# EAGLE design IPS_PilotCape (EAGLE 8.2.2)

## Sheet 1 of 2
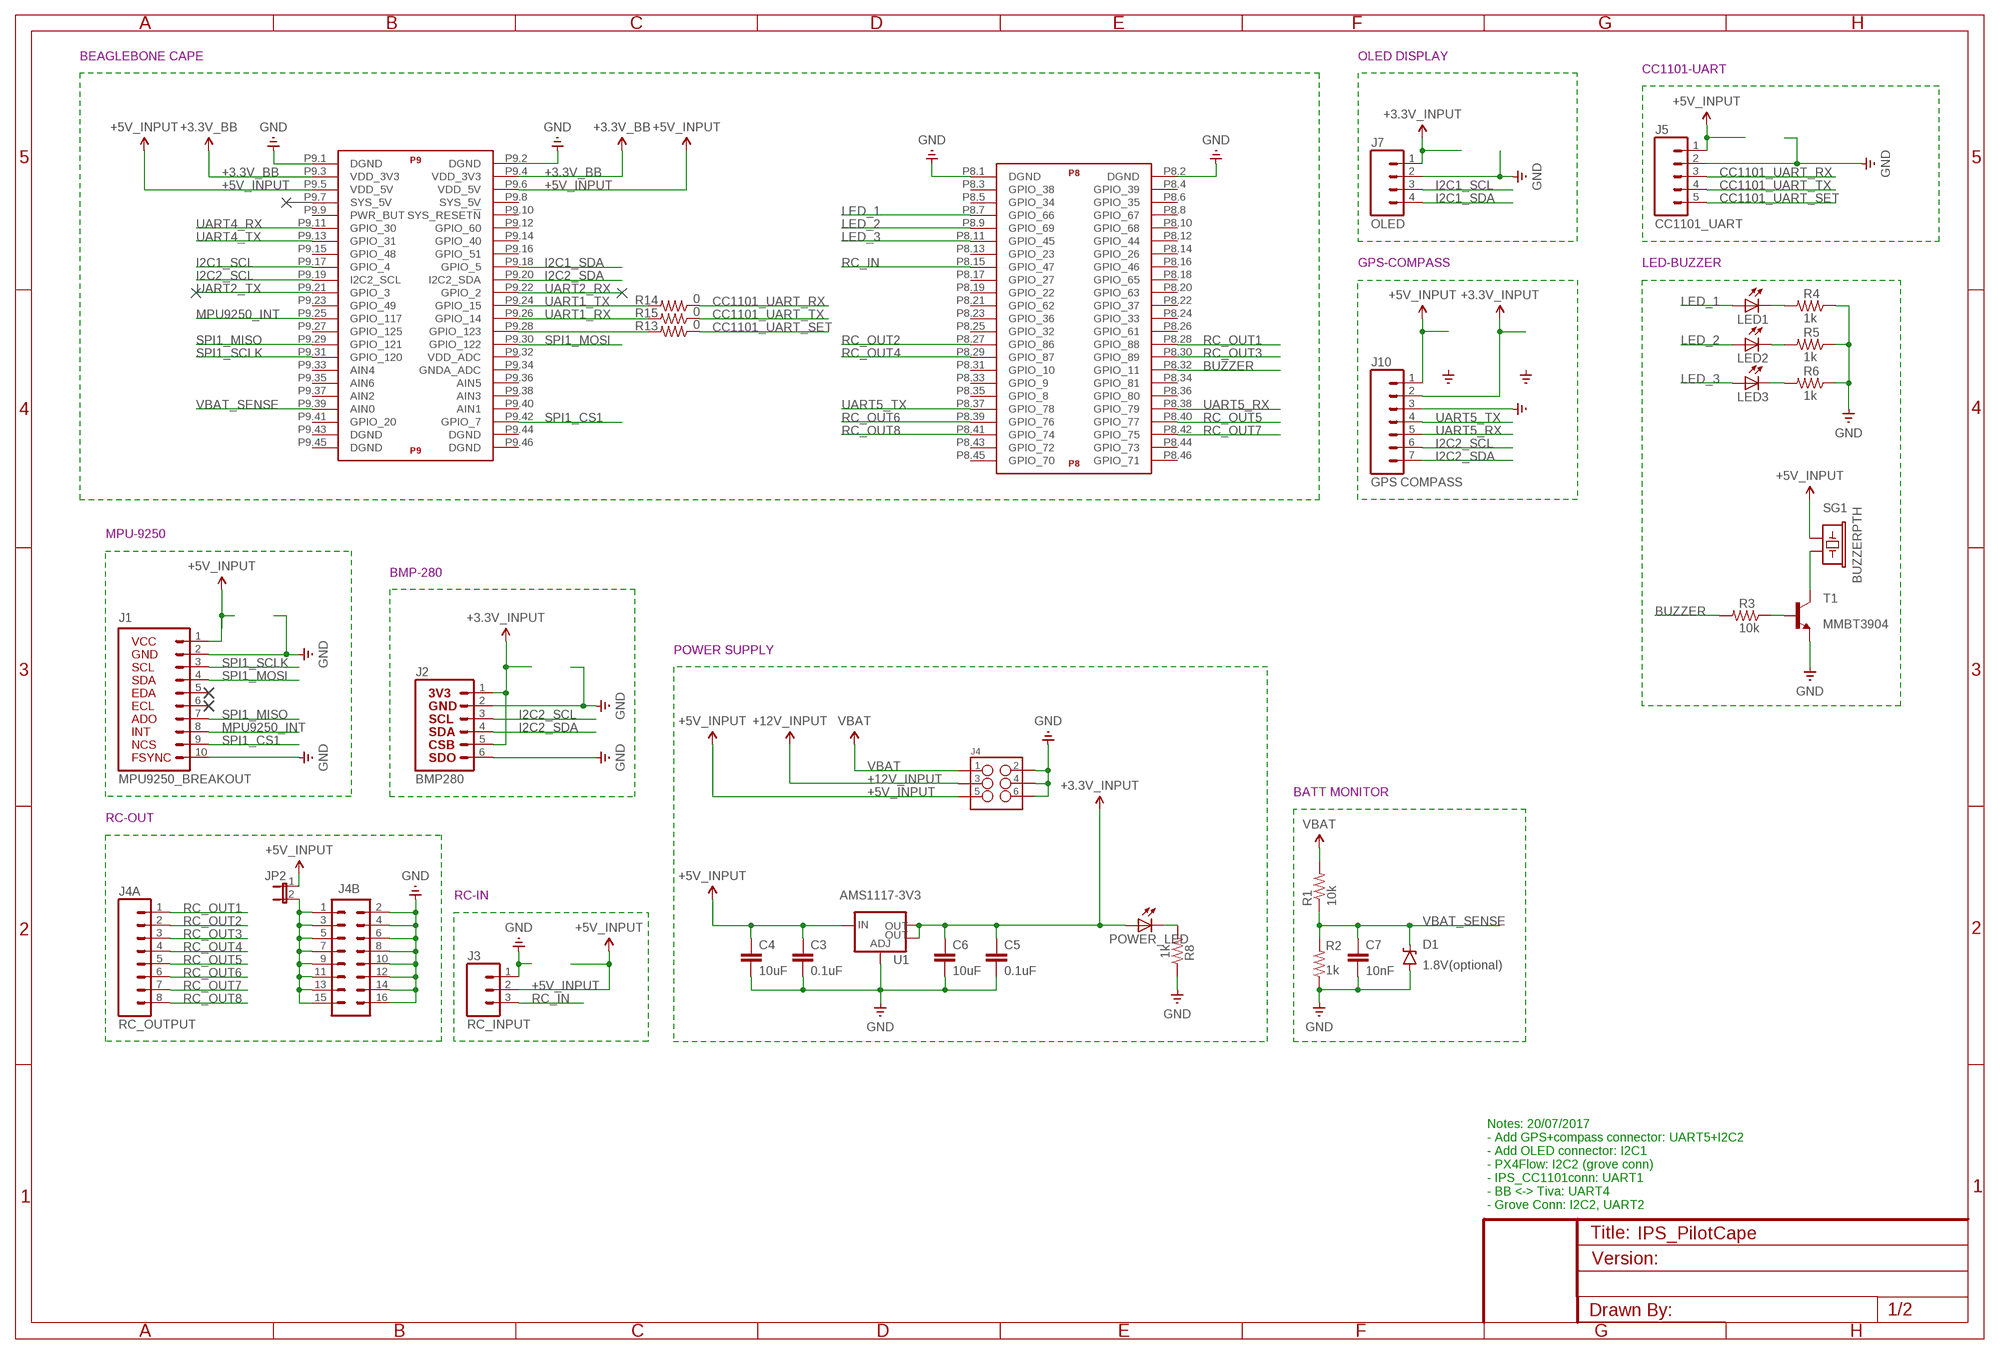
[diagram p0: schematic, sheet 1]
FRAME1 (FRAME-A3): DESIGNER: NGHIAJENIUS; VERSION: 1.0

### Parts
C3  0.1uF  CAP0603-CAP  [0603-CAP]
C4  10uF  CAP1210  [1210]
C5  0.1uF  CAP0603-CAP  [0603-CAP]
C6  10uF  CAP1210  [1210]
C7  10nF  CAP0603-CAP  [0603-CAP]
D1  1.8V(optional)  DIODE-ZENER3.3V  [SOD-323]
J1  MPU9250_BREAKOUT  [MPU9250_BREAKOUT]
J2  BMP280  [BMP280]
J3  RC_INPUT  M03PTH  [1X03]
J4  M03X2NO_SILK  [2X3-NS]
J4A  RC_OUTPUT  M08SILK_FEMALE_PTH  [1X08]
J4B  M08X2  [2X8]
J5  CC1101_UART  M05PTH  [1X05]
J7  OLED  M04PTH  [1X04]
J10  GPS COMPASS  M07  [1X07]
JP2  JUMPER-2PTH  [1X02]
LED1  LEDCHIPLED_0805  [CHIPLED_0805]
LED2  LEDCHIPLED_0805  [CHIPLED_0805]
LED3  LEDCHIPLED_0805  [CHIPLED_0805]
POWER_LED  LEDCHIPLED_0805  [CHIPLED_0805]
R1  10k  R-US_R0603  [R0603]
R2  1k  R-US_R0603  [R0603]
R3  10k  R-US_R0603  [R0603]
R4  1k  R-US_R0603  [R0603]
R5  1k  R-US_R0603  [R0603]
R6  1k  R-US_R0603  [R0603]
R8  1k  R-US_R0603  [R0603]
R13  0  R-US_R0603  [R0603]
R14  0  R-US_R0603  [R0603]
R15  0  R-US_R0603  [R0603]
SG1  BUZZERPTH  [BUZZER-12MM]
T1  MMBT3904  MMBT3904LT1-NPN-SOT23-BEC  [SOT23-BEC]
U1  AMS1117-3V3  V_REG_LM1117SOT223  [SOT223]
U$2  BEAGLE_BONE_BLACK_CAPE  [BEAGLE_BONE_BLACK_CAPE]

### Nets
+3.3V_BB: U$2.P9.3(P9:VDD_3V3) U$2.P9.4(P9:VDD_3V3)
+3.3V_INPUT: C5.1 C6.1 J2.1 J2.5 J7.1 J10.2 POWER_LED.A U1.2(OUT) U1.4(OUT) ; also sheet 2
+5V_INPUT: C3.1 C4.1 J1.1 J3.2 J4.5 J5.1 J10.1 JP2.1 SG1.+ U1.3(IN) U$2.P9.5(P9:VDD_5V) U$2.P9.6(P9:VDD_5V) ; also sheet 2
+12V_INPUT: J4.3 ; also sheet 2
BUZZER: R3.2 U$2.P8.32(P8:GPIO_11)
CC1101_UART_RX: J5.3 R14.1 ; also sheet 2
CC1101_UART_SET: J5.5 R13.1
CC1101_UART_TX: J5.4 R15.1 ; also sheet 2
GND: C3.2 C4.2 C5.2 C6.2 C7.2 D1.A J1.2 J1.10 J2.2 J2.6 J3.1 J4.2 J4.4 J4.6 J4B.2 J4B.4 J4B.6 J4B.8 J4B.10 J4B.12 J4B.14 J4B.16 J5.2 J7.2 J10.3 R2.1 R4.1 R5.1 R6.1 R8.1 T1.E U1.1(ADJ) U$2.P8.1(P8:DGND) U$2.P8.2(P8:DGND) U$2.P9.1(P9:DGND) U$2.P9.2(P9:DGND) ; also sheet 2
I2C1_SCL: J7.3 U$2.P9.17(P9:GPIO_4)
I2C1_SDA: J7.4 U$2.P9.18(P9:GPIO_5)
I2C2_SCL: J2.3 J10.6 U$2.P9.19(P9:I2C2_SCL)
I2C2_SDA: J2.4 J10.7 U$2.P9.20(P9:I2C2_SDA)
LED_1: LED1.A U$2.P8.7(P8:GPIO_66)
LED_2: LED2.A U$2.P8.9(P8:GPIO_69)
LED_3: LED3.A U$2.P8.11(P8:GPIO_45)
MPU9250_INT: J1.8 U$2.P9.25(P9:GPIO_117)
N$3: J4B.1 J4B.3 J4B.5 J4B.7 J4B.9 J4B.11 J4B.13 J4B.15 JP2.2
N$8: SG1.- T1.C
N$9: R3.1 T1.B
N$13: LED1.C R4.2
N$14: LED2.C R5.2
N$15: LED3.C R6.2
N$30: POWER_LED.C R8.2
N$34: R13.2 U$2.P9.28(P9:GPIO_123)
RC_IN: J3.3 U$2.P8.15(P8:GPIO_47)
RC_OUT1: J4A.1 U$2.P8.28(P8:GPIO_88)
RC_OUT2: J4A.2 U$2.P8.27(P8:GPIO_86)
RC_OUT3: J4A.3 U$2.P8.30(P8:GPIO_89)
RC_OUT4: J4A.4 U$2.P8.29(P8:GPIO_87)
RC_OUT5: J4A.5 U$2.P8.40(P8:GPIO_77)
RC_OUT6: J4A.6 U$2.P8.39(P8:GPIO_76)
RC_OUT7: J4A.7 U$2.P8.42(P8:GPIO_75)
RC_OUT8: J4A.8 U$2.P8.41(P8:GPIO_74)
SPI1_CS1: J1.9 U$2.P9.42(P9:GPIO_7)
SPI1_MISO: J1.7 U$2.P9.29(P9:GPIO_121)
SPI1_MOSI: J1.4 U$2.P9.30(P9:GPIO_122)
SPI1_SCLK: J1.3 U$2.P9.31(P9:GPIO_120)
UART1_RX: R15.2 U$2.P9.26(P9:GPIO_14)
UART1_TX: R14.2 U$2.P9.24(P9:GPIO_15)
UART2_RX: U$2.P9.22(P9:GPIO_2)
UART2_TX: U$2.P9.21(P9:GPIO_3)
UART4_RX: U$2.P9.11(P9:GPIO_30) ; also sheet 2
UART4_TX: U$2.P9.13(P9:GPIO_31) ; also sheet 2
UART5_RX: J10.5 U$2.P8.38(P8:GPIO_79)
UART5_TX: J10.4 U$2.P8.37(P8:GPIO_78)
VBAT: J4.1 R1.2
VBAT_SENSE: C7.1 D1.C R1.1 R2.2 U$2.P9.39(P9:AIN0)
Unconnected: J1.5 J1.6 U$2.P8.3(P8:GPIO_38) U$2.P8.4(P8:GPIO_39) U$2.P8.5(P8:GPIO_34) U$2.P8.6(P8:GPIO_35) U$2.P8.8(P8:GPIO_67) U$2.P8.10(P8:GPIO_68) U$2.P8.12(P8:GPIO_44) U$2.P8.13(P8:GPIO_23) U$2.P8.14(P8:GPIO_26) U$2.P8.16(P8:GPIO_46) U$2.P8.17(P8:GPIO_27) U$2.P8.18(P8:GPIO_65) U$2.P8.19(P8:GPIO_22) U$2.P8.20(P8:GPIO_63) U$2.P8.21(P8:GPIO_62) U$2.P8.22(P8:GPIO_37) U$2.P8.23(P8:GPIO_36) U$2.P8.24(P8:GPIO_33) U$2.P8.25(P8:GPIO_32) U$2.P8.26(P8:GPIO_61) U$2.P8.31(P8:GPIO_10) U$2.P8.33(P8:GPIO_9) U$2.P8.34(P8:GPIO_81) U$2.P8.35(P8:GPIO_8) U$2.P8.36(P8:GPIO_80) U$2.P8.43(P8:GPIO_72) U$2.P8.44(P8:GPIO_73) U$2.P8.45(P8:GPIO_70) U$2.P8.46(P8:GPIO_71) U$2.P9.7(P9:SYS_5V) U$2.P9.8(P9:SYS_5V) U$2.P9.9(P9:PWR_BUT) U$2.P9.10(P9:SYS_RESET!N) U$2.P9.12(P9:GPIO_60) U$2.P9.14(P9:GPIO_40) U$2.P9.15(P9:GPIO_48) U$2.P9.16(P9:GPIO_51) U$2.P9.23(P9:GPIO_49) U$2.P9.27(P9:GPIO_125) U$2.P9.32(P9:VDD_ADC) U$2.P9.33(P9:AIN4) U$2.P9.34(P9:GNDA_ADC) U$2.P9.35(P9:AIN6) U$2.P9.36(P9:AIN5) U$2.P9.37(P9:AIN2) U$2.P9.38(P9:AIN3) U$2.P9.40(P9:AIN1) U$2.P9.41(P9:GPIO_20) U$2.P9.43(P9:DGND) U$2.P9.44(P9:DGND) U$2.P9.45(P9:DGND) U$2.P9.46(P9:DGND)

### Notes on the sheet
- BEAGLEBONE CAPE | OLED DISPLAY
- CC1101-UART
- GPS-COMPASS | LED-BUZZER
- MPU-9250
- BMP-280
- POWER SUPPLY
- BATT MONITOR
- RC-OUT
- RC-IN
- Notes: 20/07/2017
  - Add GPS+compass connector: UART5+I2C2
  - Add OLED connector: I2C1
  - PX4Flow: I2C2 (grove conn)
  - IPS_CC1101conn: UART1
  - BB <-> Tiva: UART4
  - Grove Conn: I2C2, UART2

## Sheet 2 of 2
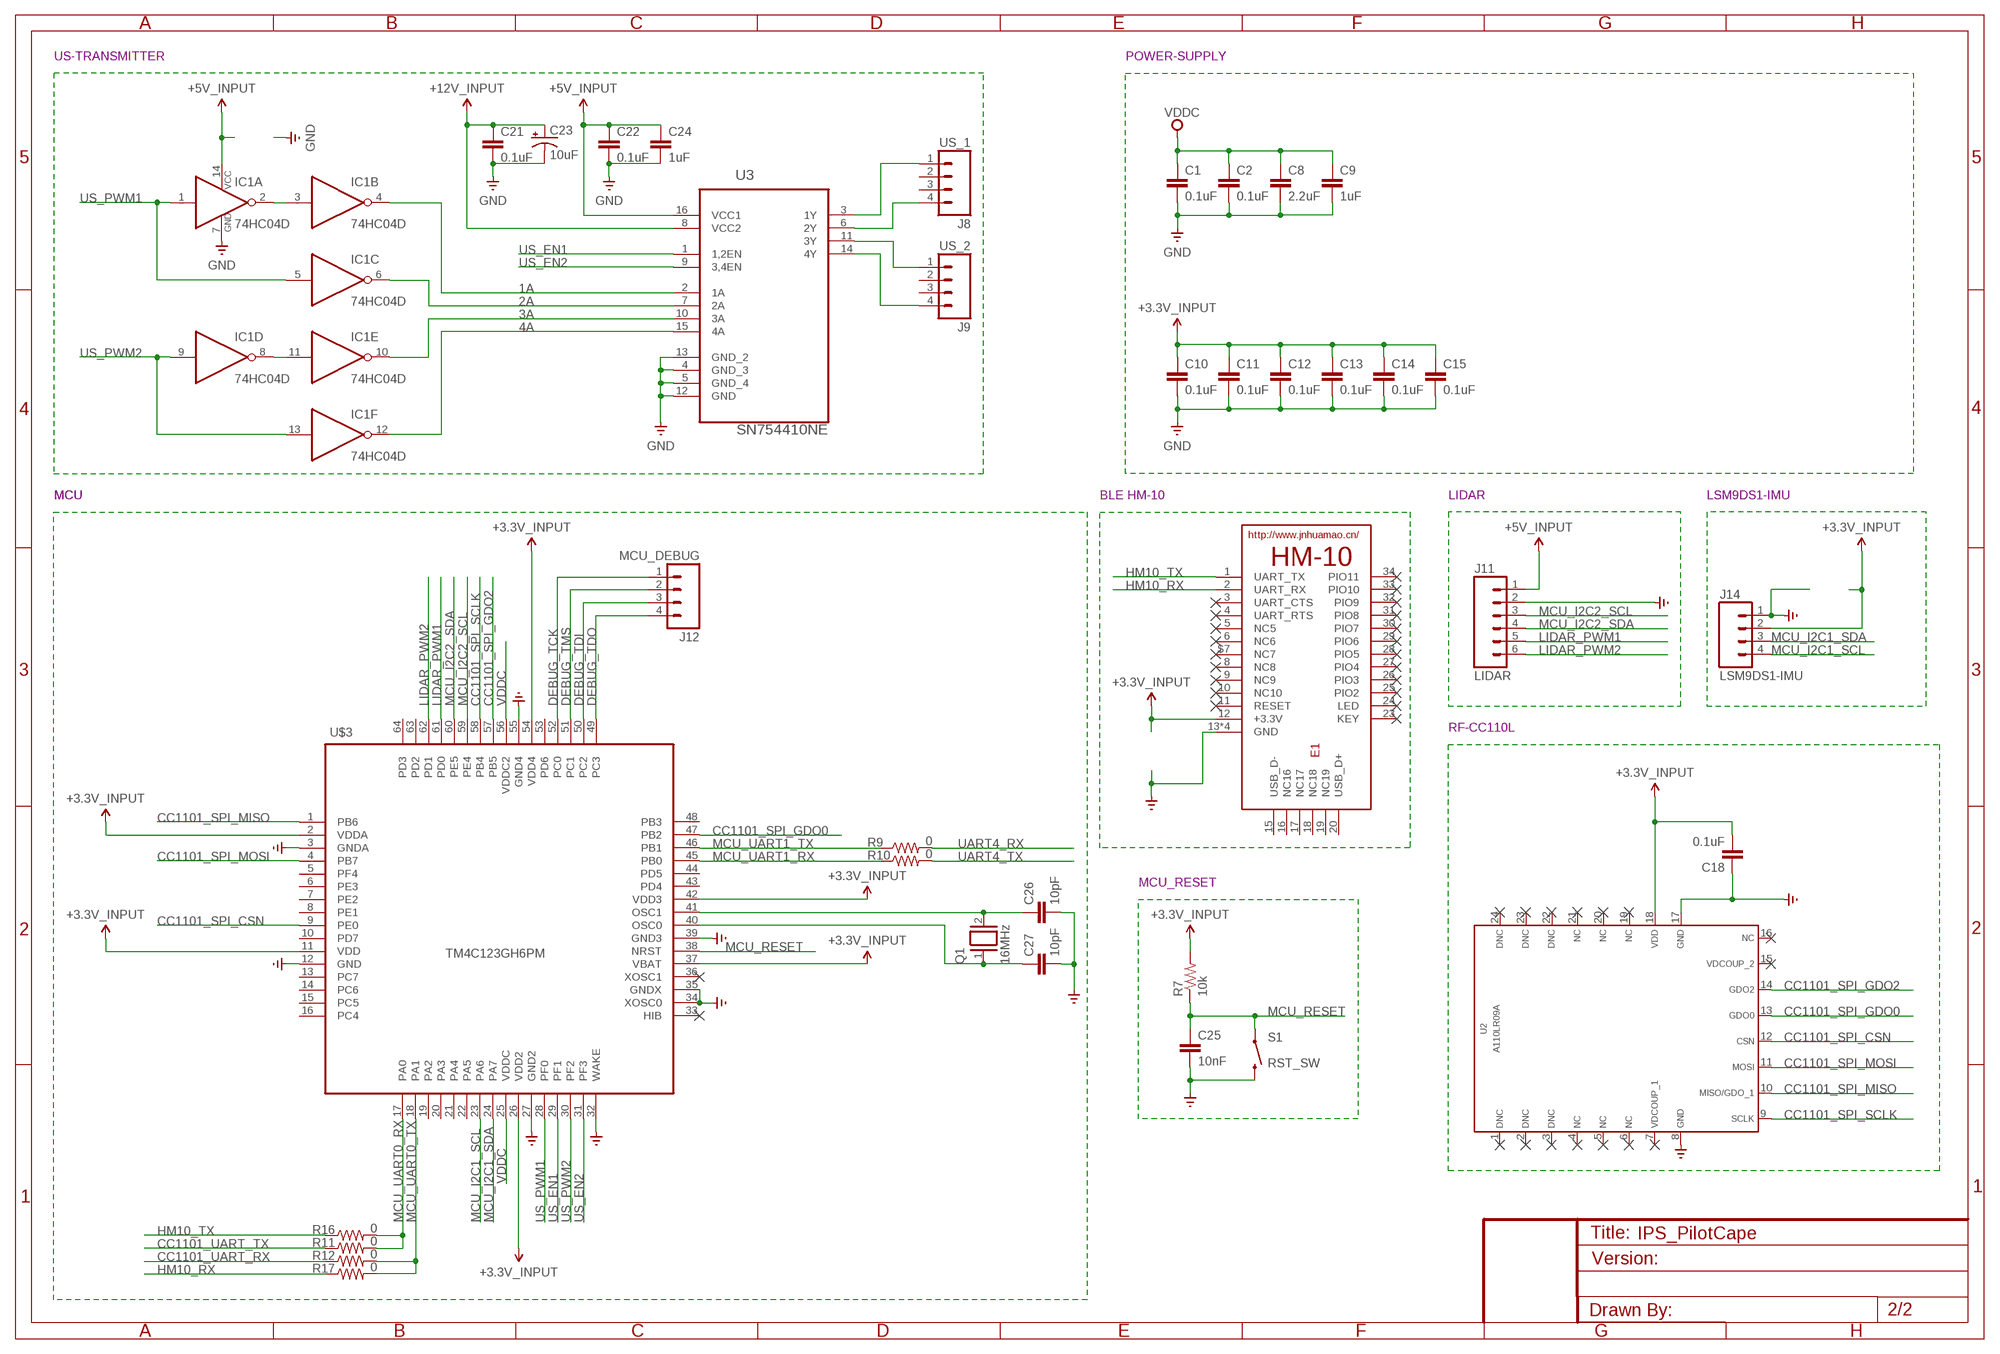
[diagram p1: schematic, sheet 2]
FRAME2 (FRAME-A3): DESIGNER: NGHIAJENIUS; VERSION: 1.0

### Parts
C1  0.1uF  CAP0603-CAP  [0603-CAP]
C2  0.1uF  CAP0603-CAP  [0603-CAP]
C8  2.2uF  CAP0603-CAP  [0603-CAP]
C9  1uF  CAP0603-CAP  [0603-CAP]
C10  0.1uF  CAP0603-CAP  [0603-CAP]
C11  0.1uF  CAP0603-CAP  [0603-CAP]
C12  0.1uF  CAP0603-CAP  [0603-CAP]
C13  0.1uF  CAP0603-CAP  [0603-CAP]
C14  0.1uF  CAP0603-CAP  [0603-CAP]
C15  0.1uF  CAP0603-CAP  [0603-CAP]
C18  0.1uF  CAP0603-CAP  [0603-CAP]
C21  0.1uF  CAP0603-CAP  [0603-CAP]
C22  0.1uF  CAP0603-CAP  [0603-CAP]
C23  10uF  10UF-16V-10%(TANT)  [EIA3216]
C24  1uF  CAP0603-CAP  [0603-CAP]
C25  10nF  CAP0603-CAP  [0603-CAP]
C26  10pF  CAP0603-CAP  [0603-CAP]
C27  10pF  CAP0603-CAP  [0603-CAP]
E1  HM-10-BOARD  [26.9X13X2.2_BOARD]
IC1  74HC04D  [SO14]
J8  US_1  M04PTH  [1X04]
J9  US_2  M04PTH  [1X04]
J11  LIDAR  M06SILK_FEMALE_PTH  [1X06]
J12  MCU_DEBUG  M04PTH  [1X04]
J14  LSM9DS1-IMU  M04PTH  [1X04]
Q1  16MHz  XTAL/S  [QS]
R7  10k  R-US_R0603  [R0603]
R9  0  R-US_R0603  [R0603]
R10  0  R-US_R0603  [R0603]
R11  0  R-US_R0603  [R0603]
R12  0  R-US_R0603  [R0603]
R16  0  R-US_R0603  [R0603]
R17  0  R-US_R0603  [R0603]
S1  RST_SW  SWITCH-MOMENTARY-2SMD-1101NE  [TACTILE-SWITCH-1101NE]
U2  A110LR09A  [A110LR09A]
U3  SN754410NE  [DIP254P762X508-16]
U$3  TM4C123GH6PM  [LQPF-64]

### Nets
1A: IC1.4(B:O) U3.2(1A)
2A: IC1.6(C:O) U3.7(2A)
3A: IC1.10(E:O) U3.10(3A)
4A: IC1.12(F:O) U3.15(4A)
+3.3V_INPUT: C10.1 C11.1 C12.1 C13.1 C14.1 C15.1 C18.2 E1.12(+3.3V) J14.2 R7.2 U2.18 U$3.2(VDDA) U$3.11(VDD) U$3.26(VDD2) U$3.37(VBAT) U$3.42(VDD3) U$3.54(VDD4) ; also sheet 1
+5V_INPUT: C22.1 C24.1 IC1.14(P:VCC) J11.1 U3.16(VCC1) ; also sheet 1
+12V_INPUT: C21.1 C23.A(+) U3.8(VCC2) ; also sheet 1
CC1101_SPI_CSN: U2.12 U$3.9(PE0)
CC1101_SPI_GDO0: U2.13 U$3.47(PB2)
CC1101_SPI_GDO2: U2.14 U$3.57(PB5)
CC1101_SPI_MISO: U2.10 U$3.1(PB6)
CC1101_SPI_MOSI: U2.11 U$3.4(PB7)
CC1101_SPI_SCLK: U2.9 U$3.58(PB4)
CC1101_UART_RX: R12.1 ; also sheet 1
CC1101_UART_TX: R11.1 ; also sheet 1
DEBUG_TCK: J12.1 U$3.52(PC0)
DEBUG_TDI: J12.3 U$3.50(PC2)
DEBUG_TDO: J12.4 U$3.49(PC3)
DEBUG_TMS: J12.2 U$3.51(PC1)
GND: C1.2 C2.2 C8.2 C9.2 C10.2 C11.2 C12.2 C13.2 C14.2 C15.2 C18.1 C21.2 C22.2 C23.C(-) C24.2 C25.2 C26.2 C27.2 E1.13(GND) E1.14(GND) E1.21(GND) E1.22(GND) IC1.7(P:GND) J11.2 J14.1 S1.2 U2.8 U2.17 U3.4(GND_3) U3.5(GND_4) U3.12(GND) U3.13(GND_2) U$3.3(GNDA) U$3.12(GND) U$3.27(GND2) U$3.32(WAKE) U$3.34(XOSC0) U$3.35(GNDX) U$3.39(GND3) U$3.55(GND4) ; also sheet 1
HM10_RX: E1.2(UART_RX) R17.1
HM10_TX: E1.1(UART_TX) R16.1
LIDAR_PWM1: J11.5 U$3.61(PD0)
LIDAR_PWM2: J11.6 U$3.62(PD1)
MCU_I2C1_SCL: J14.4 U$3.23(PA6)
MCU_I2C1_SDA: J14.3 U$3.24(PA7)
MCU_I2C2_SCL: J11.3 U$3.59(PE4)
MCU_I2C2_SDA: J11.4 U$3.60(PE5)
MCU_RESET: C25.1 R7.1 S1.1 U$3.38(NRST)
MCU_UART0_RX: R11.2 R16.2 U$3.17(PA0)
MCU_UART0_TX: R12.2 R17.2 U$3.18(PA1)
MCU_UART1_RX: R10.1 U$3.45(PB0)
MCU_UART1_TX: R9.1 U$3.46(PB1)
N$18: J8.1 U3.3(1Y)
N$19: J8.4 U3.6(2Y)
N$20: IC1.2(A:O) IC1.3(B:I)
N$23: IC1.8(D:O) IC1.11(E:I)
N$26: J9.1 U3.11(3Y)
N$27: J9.4 U3.14(4Y)
N$28: C26.1 Q1.2 U$3.41(OSC1)
N$29: C27.1 Q1.1 U$3.40(OSC0)
UART4_RX: R9.2 ; also sheet 1
UART4_TX: R10.2 ; also sheet 1
US_EN1: U3.1(1,2EN) U$3.29(PF1)
US_EN2: U3.9(3,4EN) U$3.31(PF3)
US_PWM1: IC1.1(A:I) IC1.5(C:I) U$3.28(PF0)
US_PWM2: IC1.9(D:I) IC1.13(F:I) U$3.30(PF2)
VDDC: C1.1 C2.1 C8.1 C9.1 U$3.25(VDDC) U$3.56(VDDC2)
Unconnected: E1.3(UART_CTS) E1.4(UART_RTS) E1.5(NC5) E1.6(NC6) E1.8(NC8) E1.9(NC9) E1.10(NC10) E1.11(RESET) E1.15(USB_D-) E1.16(NC16) E1.17(NC17) E1.18(NC18) E1.19(NC19) E1.20(USB_D+) E1.23(KEY) E1.24(LED) E1.25(PIO2) E1.26(PIO3) E1.27(PIO4) E1.28(PIO5) E1.29(PIO6) E1.30(PIO7) E1.31(PIO8) E1.32(PIO9) E1.33(PIO10) E1.34(PIO11) E1.$7(NC7) J8.2 J8.3 J9.2 J9.3 U2.1 U2.2 U2.3 U2.4 U2.5 U2.6 U2.7 U2.15 U2.16 U2.19 U2.20 U2.21 U2.22 U2.23 U2.24 U$3.5(PF4) U$3.6(PE3) U$3.7(PE2) U$3.8(PE1) U$3.10(PD7) U$3.13(PC7) U$3.14(PC6) U$3.15(PC5) U$3.16(PC4) U$3.19(PA2) U$3.20(PA3) U$3.21(PA4) U$3.22(PA5) U$3.33(HIB) U$3.36(XOSC1) U$3.43(PD4) U$3.44(PD5) U$3.48(PB3) U$3.53(PD6) U$3.63(PD2) U$3.64(PD3)

### Notes on the sheet
- US-TRANSMITTER | POWER-SUPPLY
- MCU | MCU | BLE HM-10 | LIDAR | LSM9DS1-IMU
- RF-CC110L
- MCU_RESET

## Library data of the parts
C1-C3 C5 C7-C15 C18 C21 C22 C24-C27 = SparkFun-Capacitors:CAP: Capacitor Standard 0603 ceramic capacitor, and 0.1" leaded capacitor.
C4 C6 = SparkFun-Passives:CAP: Capacitor Standard 0603 ceramic capacitor, and 0.1" leaded capacitor.
C23 = SparkFun-Capacitors:10UF-16V-10%(TANT): CAP-00811 1206/EIA-3216 Tantalum capacitor; PROD_ID: CAP-00811
D1 = SparkFun-DiscreteSemi:DIODE-ZENER: Zener Diode Production Part - 8199 3.4V Zener Voltage; PROD_ID: DIO-11284; VALUE: 3.3V
E1 = JNHuaMao:HM-10: HM Bluetooth module use TI CC2540 or CC2541, Master and slave roles in one, transmission version and remote control version and PIO state acquisition functions in one, Support the AT command modify module parameters, Convenient and flexible.
IC1 = 74xx-eu:74*04: Hex INVERTER
J1 = nghiajenius_lib:MPU9250_BREAKOUT
J2 = nghiajenius_lib:BMP280
J3 = SparkFun-Connectors:M03: Header 3 Standard 3-pin 0.1" header. Use with straight break away headers (SKU : PRT-00116), right angle break away headers (PRT-00553), swiss pins (PRT-00743), machine pins (PRT-00117), and female headers (PRT-00115). Molex polarized connector foot print use with SKU : PRT-08232 with associated crimp pins and housings.
J4 = SparkFun-Connectors:M03X2: 2x3 .1" header. Shrouded, with keying- CONN-10681 SMT- CONN-11415 Pogo pins- HW-11044
J4A = SparkFun-Connectors:M08: Header 8 Standard 8-pin 0.1" header. Use with straight break away headers (SKU : PRT-00116), right angle break away headers (PRT-00553), swiss pins (PRT-00743), machine pins (PRT-00117), and female headers (PRT-00115).; PROD_ID: CONN-08438
J4B = SparkFun-Connectors:M08X2: .1" headers, two rows of 8 each
J5 = SparkFun-Connectors:M05: Header 5 Standard 5-pin 0.1" header. Use with straight break away headers (SKU : PRT-00116), right angle break away headers (PRT-00553), swiss pins (PRT-00743), machine pins (PRT-00117), and female headers (PRT-00115). Molex polarized connector foot print use with SKU : PRT-08230 with associated crimp pins and housings.
J7-J9 J12 J14 = SparkFun-Connectors:M04: Header 4 Standard 4-pin 0.1" header. Use with straight break away headers (SKU : PRT-00116), right angle break away headers (PRT-00553), swiss pins (PRT-00743), machine pins (PRT-00117), and female headers (PRT-00115). Molex polarized connector foot print use with SKU : PRT-08231 with associated crimp pins and housings. 1MM SMD Version SKU: PRT-10208; PROD_ID: CONN-09696
J10 = SparkFun-Connectors:M07: Header 7 Standard 7-pin 0.1" header. Use with straight break away headers (SKU : PRT-00116), right angle break away headers (PRT-00553), swiss pins (PRT-00743), machine pins (PRT-00117), and female headers (PRT-00115). NOTES ON THE VARIANTS LOCK and LOCK_LONGPADS... This footprint was designed to help hold the alignment of a through-hole component (i.e. 7-pin header) while soldering it into place. You may notice that each hole has been shifted either up or down by 0.005 of an inch from it's more standard position (which is usually a perfectly straight line). This slight alteration caused the pins (the squares in the middle) to touch the edges of the holes. Because they are alternating, it causes a "brace" to hold the header in place. 0.005 has proven to be the perfect amount of "off-center" position when using our standard breakaway headers. Although looks a little odd when you look at the bare footprint, once you have a header in there, the alteration is very hard to notice. Also, if you push a header all the way into place, it is covered up entirely on the bottom side. This idea of altering the position of holes to aid alignment will be further integrated into the Sparkfun Library for other footprints. It can help hold any component with 3 or more connection pins.
J11 = SparkFun-Connectors:M06: Header 6 Standard 6-pin 0.1" header. Use with straight break away headers (SKU : PRT-00116), right angle break away headers (PRT-00553), swiss pins (PRT-00743), machine pins (PRT-00117), and female headers (PRT-00115). Molex polarized connector foot print use with SKU : PRT-08094 with associated crimp pins and housings. NOTES ON THE VARIANTS LOCK and LOCK_LONGPADS... This footprint was designed to help hold the alignment of a through-hole component (i.e. 6-pin header) while soldering it into place. You may notice that each hole has been shifted either up or down by 0.005 of an inch from it's more standard position (which is a perfectly straight line). This slight alteration caused the pins (the squares in the middle) to touch the edges of the holes. Because they are alternating, it causes a "brace" to hold the component in place. 0.005 has proven to be the perfect amount of "off-center" position when using our standard breakaway headers. Although looks a little odd when you look at the bare footprint, once you have a header in there, the alteration is very hard to notice. Also,if you push a header all the way into place, it is covered up entirely on the bottom side. This idea of altering the position of holes to aid alignment will be further integrated into the Sparkfun Library for other footprints. It can help hold any component with 3 or more connection pins.; PROD_ID: CONN-08437
JP2 = SparkFun-Retired:JUMPER-2: Jumper Basic 0.1" spaced jumper. Use with breakaway headers.
LED1-LED3 POWER_LED = adafruit:LED: LED OSRAM: - CHIPLED LG R971, LG N971, LY N971, LG Q971, LY Q971, LO R971, LY R971 LH N974, LH R974 LS Q976, LO Q976, LY Q976 LO Q996 - Hyper CHIPLED LW Q18S LB Q993, LB Q99A, LB R99A - SideLED LS A670, LO A670, LY A670, LG A670, LP A670 LB A673, LV A673, LT A673, LW A673 LH A674 LY A675 LS A676, LA A676, LO A676, LY A676, LW A676 LS A679, LY A679, LG A679 - Hyper Micro SIDELED® LS Y876, LA Y876, LO Y876, LY Y876 LT Y87S - SmartLED LW L88C, LW L88S LB L89C, LB L89S, LG L890 LS L89K, LO L89K, LY L89K LS L896, LA L896, LO L896, LY L896 - TOPLED LS T670, LO T670, LY T670, LG T670, LP T670 LSG T670, LSP T670, LSY T670, LOP T670, LYG T670 LG T671, LOG T671, LSG T671 LB T673, LV T673, LT T673, LW T673 LH T674 LS T676, LA T676, LO T676, LY T676, LB T676, LH T676, LSB T676, LW T676 LB T67C, LV T67C, LT T67C, LS T67K, LO T67K, LY T67K, LW E67C LS E67B, LA E67B, LO E67B, LY E67B, LB E67C, LV E67C, LT E67C LW T67C LS T679, LY T679, LG T679 LS T770, LO T770, LY T770, LG T770, LP T770 LB T773, LV T773, LT T773, LW T773 LH T774 LS E675, LA E675, LY E675, LS T675 LS T776, LA T776, LO T776, LY T776, LB T776 LHGB T686 LT T68C, LB T68C - Hyper Mini TOPLED® LB M676 - Mini TOPLED Santana® LG M470 LS M47K, LO M47K, LY M47K Source: http://www.osram.convergy.de/
Q1 = special:XTAL/S: CRYSTAL
R1-R17 = resistor:R-US_: RESISTOR, American symbol
S1 = SparkFun-Electromechanical:SWITCH-MOMENTARY-2: Various NO switches- pushbuttons, reed, etc; PROD_ID: SWCH-00815
SG1 = SparkFun-Electromechanical:BUZZER: Buzzer 12mm Spark Fun Electronics SKU : Comp-Buzzer
T1 = transistor-neu-to92:*-NPN-: NPN Transistror
U1 = SparkFun-PowerIC:V_REG_LM1117: Voltage Regulator LM1117 Standard adjustable voltage regulator but in SMD form. Spark Fun Electronics SKU : COM-00595; PROD_ID: VREG-08170
U2 = AIR_Modules:A110LR09*
U3 = Texas Instruments_By_element14_Batch_1:SN754410NE: QUADRUPLE HALF-H DRIVERS; MPN: SN754410NE; OC_FARNELL: 1470411; OC_NEWARK: 08F8145; PACKAGE: PDIP-16; SUPPLIER: Texas Instruments
U$2 = SparkFun-Boards:BEAGLE_BONE_BLACK_CAPE
U$3 = nghiajenius_lib:TM4C123GH6PM

## Board
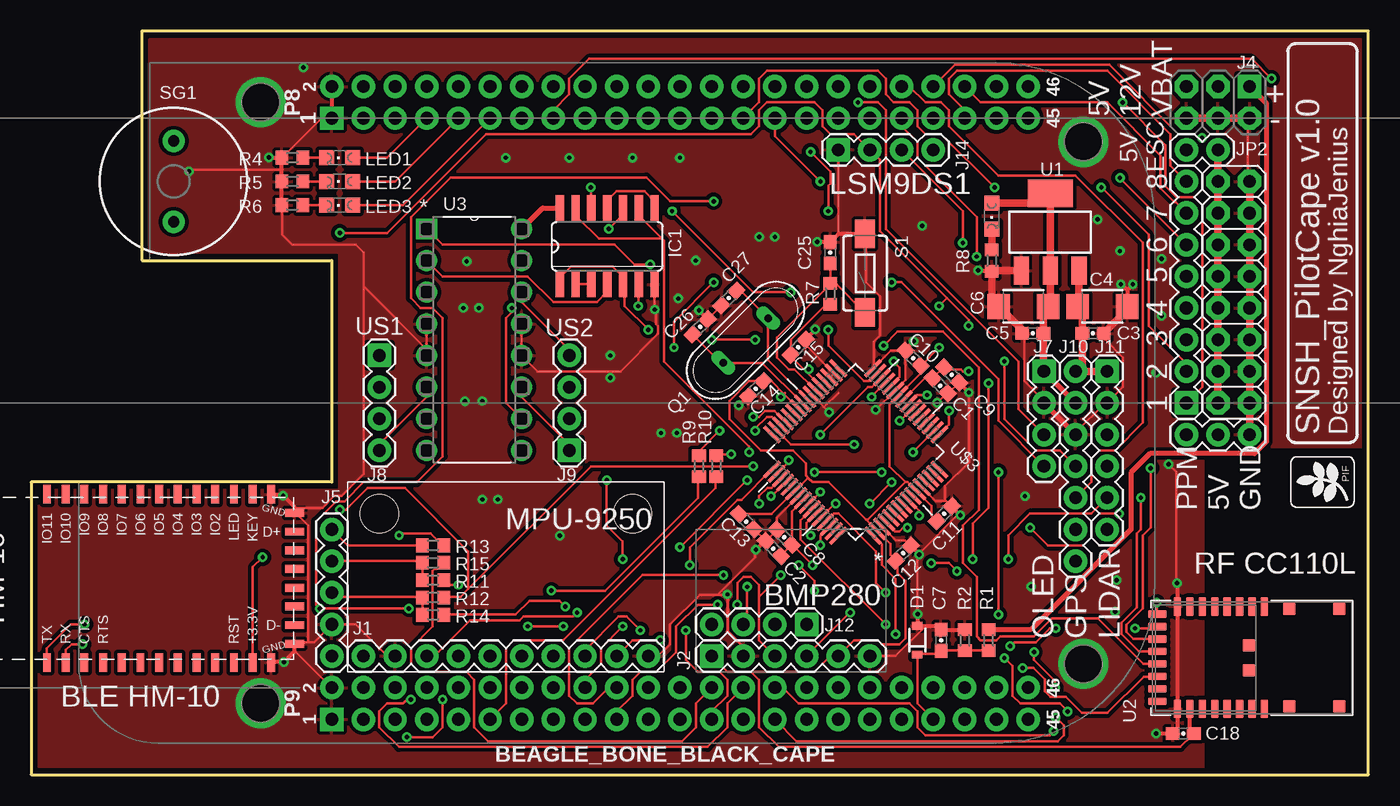
[diagram p2: board, top side]
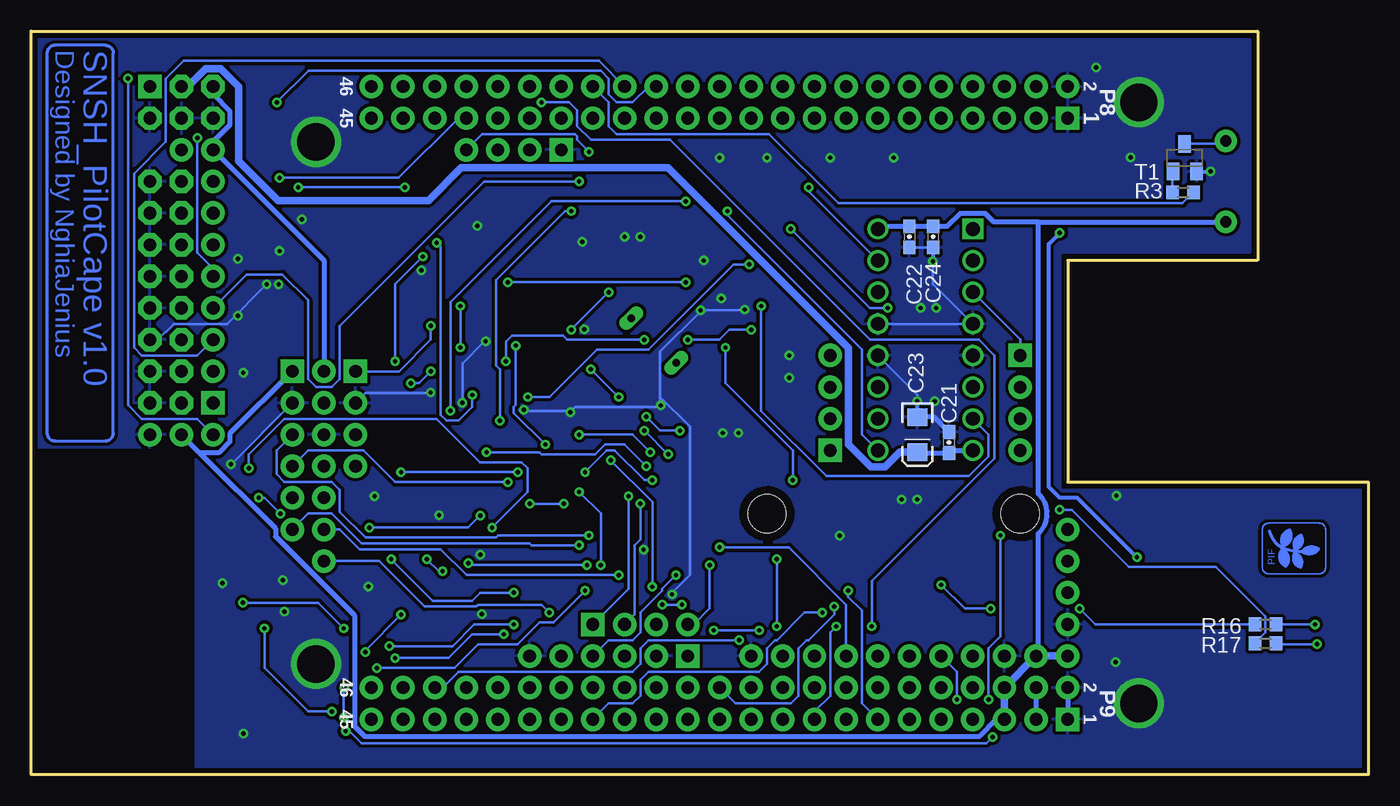
[diagram p3: board, bottom side, seen from below]

Size 107.31 x 59.69 mm. Coordinates in mm from the lower left corner, seen from the top.
Outline: 8.89,59.69 8.89,41.27 24.13,41.27 24.13,23.5 0,23.5 0,0 107.31,0 107.31,59.69 8.89,59.69
Copper layers (1*16): Top 0.035mm / dielectric 1.6mm / Bottom 0.035mm
Design rules "vntech24h-rule": minimum track width 8mil, minimum drill 0.35mm, track to track 8mil, track to pad 8mil, pad to pad 8mil, via to via 8mil, smd to smd 0mil, copper to edge 0mil, drill to drill 6mil, minimum pad ring 10mil, minimum via ring 8mil, stop-mask expansion 4mil, vias tented up to drill 0mil, thermal gap 10mil

### Footprints (pad centres in the part's own frame; a part is rotated, then mirrored left to right if it is on the bottom)
0603-CAP = smd 1.1 x 1: 1 -0.85,0; 2 0.85,0
1210 = smd 1.8 x 2: 1 -1.981,0; 2 1.981,0
EIA3216 = smd 1.4 x 1.6: A 1.4,0; C -1.4,0
SOD-323 = smd 0.63 x 0.83: A 1.15,0; C -1.15,0
26.9X13X2.2_BOARD = smd 1.5 x 0.635: 1 -7.5,0; 2 -7.5,-1.5; 3 -7.5,-3; 4 -7.5,-4.5; 5 -7.5,-6; 6 -7.5,-7.5; 8 -7.5,-10.5; 9 -7.5,-12; 10 -7.5,-13.5; 11 -7.5,-15; 12 -7.5,-16.5; 13 -7.5,-18; 22 6,-18; 23 6,-16.5; 24 6,-15; 25 6,-13.5; 26 6,-12; 27 6,-10.5; 28 6,-9; 29 6,-7.5; 30 6,-6; 31 6,-4.5; 32 6,-3; 33 6,-1.5; 34 6,0; $7 -7.5,-9 | smd 0.635 x 1.5: 14 -6,-19.875; 15 -4.5,-19.875; 16 -3,-19.875; 17 -1.5,-19.875; 18 0,-19.875; 19 1.5,-19.875; 20 3,-19.875; 21 4.5,-19.875
SO14 = smd 0.66 x 2.032: 1 -3.81,-3.073; 2 -2.54,-3.073; 3 -1.27,-3.073; 4 0,-3.073; 5 1.27,-3.073; 6 2.54,-3.073; 7 3.81,-3.073; 8 3.81,3.073; 9 2.54,3.073; 10 1.27,3.073; 11 0,3.073; 12 -1.27,3.073; 13 -2.54,3.073; 14 -3.81,3.073
MPU9250_BREAKOUT = drill 1.016 pad 1.88: 1 0,0; 2 2.54,0; 3 5.08,0; 4 7.62,0; 5 10.16,0; 6 12.7,0; 7 15.24,0; 8 17.78,0; 9 20.32,0; 10 22.86,0 | hole 3.048: 1.27,11.43; 21.59,11.43
BMP280 = drill 1.016 pad 1.88 square: 1 0,0 | drill 1.016 pad 1.88: 2 2.54,0; 3 5.08,0; 4 7.62,0; 5 10.16,0; 6 12.7,0
1X03 = drill 1.016 pad 1.88: 1 0,0; 2 2.54,0; 3 5.08,0
2X3-NS = drill 1.016 pad 1.88 square: 1 -2.54,-1.27 | drill 1.016 pad 1.88 octagon: 2 -2.54,1.27; 3 0,-1.27; 4 0,1.27; 5 2.54,-1.27; 6 2.54,1.27
1X08 = drill 1.016 pad 1.88 square: 1 0,0 | drill 1.016 pad 1.88: 2 2.54,0; 3 5.08,0; 4 7.62,0; 5 10.16,0; 6 12.7,0; 7 15.24,0; 8 17.78,0
2X8 = drill 1.016 pad 1.88 octagon: 1 0,0; 2 0,2.54; 3 2.54,0; 4 2.54,2.54; 5 5.08,0; 6 5.08,2.54; 7 7.62,0; 8 7.62,2.54; 9 10.16,0; 10 10.16,2.54; 11 12.7,0; 12 12.7,2.54; 13 15.24,0; 14 15.24,2.54; 15 17.78,0; 16 17.78,2.54
1X05 = drill 1.016 pad 1.88: 1 0,0; 2 2.54,0; 3 5.08,0; 4 7.62,0; 5 10.16,0
1X04 = drill 1.016 pad 1.88 square: 1 0,0 | drill 1.016 pad 1.88: 2 2.54,0; 3 5.08,0; 4 7.62,0
1X07 = drill 1.016 pad 1.88: 1 0,0; 2 2.54,0; 3 5.08,0; 4 7.62,0; 5 10.16,0; 6 12.7,0; 7 15.24,0
1X06 = drill 1.016 pad 1.88 square: 1 0,0 | drill 1.016 pad 1.88: 2 2.54,0; 3 5.08,0; 4 7.62,0; 5 10.16,0; 6 12.7,0
1X02 = drill 1.016 pad 1.88: 1 0,0; 2 2.54,0
CHIPLED_0805 = smd 1.2 x 1.2: A 0,-1.05; C 0,1.05
QS = drill 0.61 long: 1 -2.54,0; 2 2.54,0
R0603 = smd 1 x 1.1: 1 -0.85,0; 2 0.85,0
TACTILE-SWITCH-1101NE = smd 2.3 x 1.6: 1 -3.15,0; 2 3.15,0
BUZZER-12MM = drill 0.9 pad 1.778: + 3.25,0; - -3.25,0
SOT23-BEC = smd 1 x 1.4: B -0.95,-1.1; C 0,1.1; E 0.95,-1.1
SOT223 = smd 1.219 x 2.235: 1 -2.311,-3.099; 2 0,-3.099; 3 2.311,-3.099 | smd 3.6 x 2.2: 4 0,3.099
A110LR09A = smd 1.5 x 0.61: 1 -4.105,4.5; 2 -4.105,3.5; 3 -4.105,2.5; 4 -4.105,1.5; 5 -4.105,0.5; 6 -4.105,-0.5; 7 -4.105,-1.5; 8 -4.105,-2.5; 17 4.105,-2.5; 18 4.105,-1.5; 19 4.105,-0.5; 20 4.105,0.5; 21 4.105,1.5; 22 4.105,2.5; 23 4.105,3.5; 24 4.105,4.5 | smd 0.61 x 1.5: 9 -3.5,-4.1; 10 -2.5,-4.1; 11 -1.5,-4.1; 12 -0.5,-4.1; 13 0.5,-4.1; 14 1.5,-4.1; 15 2.5,-4.1; 16 3.5,-4.1 | smd 1 x 1: P$25 -3.91,10.5; P$26 -3.91,6.5; P$27 -1,3.256; P$28 1,3.256; P$29 3.91,6.5; P$30 3.91,10.5
DIP254P762X508-16 = drill 1.118 square: 1 -7.62,17.78 | drill 1.118: 2 -7.62,15.24; 3 -7.62,12.7; 4 -7.62,10.16; 5 -7.62,7.62; 6 -7.62,5.08; 7 -7.62,2.54; 8 -7.62,0; 9 0,0; 10 0,2.54; 11 0,5.08; 12 0,7.62; 13 0,10.16; 14 0,12.7; 15 0,15.24; 16 0,17.78
BEAGLE_BONE_BLACK_CAPE = drill 1.016 pad 1.88 square: P8.1 20.32,50.8; P9.1 20.32,2.54 | drill 1.016 pad 1.88: P8.2 20.32,53.34; P8.3 22.86,50.8; P8.4 22.86,53.34; P8.5 25.4,50.8; P8.6 25.4,53.34; P8.7 27.94,50.8; P8.8 27.94,53.34; P8.9 30.48,50.8; P8.10 30.48,53.34; P8.11 33.02,50.8; P8.12 33.02,53.34; P8.13 35.56,50.8; P8.14 35.56,53.34; P8.15 38.1,50.8; P8.16 38.1,53.34; P8.17 40.64,50.8; P8.18 40.64,53.34; P8.19 43.18,50.8; P8.20 43.18,53.34; P8.21 45.72,50.8; P8.22 45.72,53.34; P8.23 48.26,50.8; P8.24 48.26,53.34; P8.25 50.8,50.8; P8.26 50.8,53.34; P8.27 53.34,50.8; P8.28 53.34,53.34; P8.29 55.88,50.8; P8.30 55.88,53.34; P8.31 58.42,50.8; P8.32 58.42,53.34; P8.33 60.96,50.8; P8.34 60.96,53.34; P8.35 63.5,50.8; P8.36 63.5,53.34; P8.37 66.04,50.8; P8.38 66.04,53.34; P8.39 68.58,50.8; P8.40 68.58,53.34; P8.41 71.12,50.8; P8.42 71.12,53.34; P8.43 73.66,50.8; P8.44 73.66,53.34; P8.45 76.2,50.8; P8.46 76.2,53.34; P9.2 20.32,5.08; P9.3 22.86,2.54; P9.4 22.86,5.08; P9.5 25.4,2.54; P9.6 25.4,5.08; P9.7 27.94,2.54; P9.8 27.94,5.08; P9.9 30.48,2.54; P9.10 30.48,5.08; P9.11 33.02,2.54; P9.12 33.02,5.08; P9.13 35.56,2.54; P9.14 35.56,5.08; P9.15 38.1,2.54; P9.16 38.1,5.08; P9.17 40.64,2.54; P9.18 40.64,5.08; P9.19 43.18,2.54; P9.20 43.18,5.08; P9.21 45.72,2.54; P9.22 45.72,5.08; P9.23 48.26,2.54; P9.24 48.26,5.08; P9.25 50.8,2.54; P9.26 50.8,5.08; P9.27 53.34,2.54; P9.28 53.34,5.08; P9.29 55.88,2.54; P9.30 55.88,5.08; P9.31 58.42,2.54; P9.32 58.42,5.08; P9.33 60.96,2.54; P9.34 60.96,5.08; P9.35 63.5,2.54; P9.36 63.5,5.08; P9.37 66.04,2.54; P9.38 66.04,5.08; P9.39 68.58,2.54; P9.40 68.58,5.08; P9.41 71.12,2.54; P9.42 71.12,5.08; P9.43 73.66,2.54; P9.44 73.66,5.08; P9.45 76.2,2.54; P9.46 76.2,5.08
LQPF-64 = smd 1.778 x 0.279: 1 -5.74,3.759; 2 -5.74,3.251; 3 -5.74,2.743; 4 -5.74,2.261; 5 -5.74,1.753; 6 -5.74,1.245; 7 -5.74,0.762; 8 -5.74,0.254; 9 -5.74,-0.254; 10 -5.74,-0.762; 11 -5.74,-1.245; 12 -5.74,-1.753; 13 -5.74,-2.261; 14 -5.74,-2.743; 15 -5.74,-3.251; 16 -5.74,-3.759; 33 5.74,-3.759; 34 5.74,-3.251; 35 5.74,-2.743; 36 5.74,-2.261; 37 5.74,-1.753; 38 5.74,-1.245; 39 5.74,-0.762; 40 5.74,-0.254; 41 5.74,0.254; 42 5.74,0.762; 43 5.74,1.245; 44 5.74,1.753; 45 5.74,2.261; 46 5.74,2.743; 47 5.74,3.251; 48 5.74,3.759 | smd 0.279 x 1.778: 17 -3.759,-5.74; 18 -3.251,-5.74; 19 -2.743,-5.74; 20 -2.261,-5.74; 21 -1.753,-5.74; 22 -1.245,-5.74; 23 -0.762,-5.74; 24 -0.254,-5.74; 25 0.254,-5.74; 26 0.762,-5.74; 27 1.245,-5.74; 28 1.753,-5.74; 29 2.261,-5.74; 30 2.743,-5.74; 31 3.251,-5.74; 32 3.759,-5.74; 49 3.759,5.74; 50 3.251,5.74; 51 2.743,5.74; 52 2.261,5.74; 53 1.753,5.74; 54 1.245,5.74; 55 0.762,5.74; 56 0.254,5.74; 57 -0.254,5.74; 58 -0.762,5.74; 59 -1.245,5.74; 60 -1.753,5.74; 61 -2.261,5.74; 62 -2.743,5.74; 63 -3.251,5.74; 64 -3.759,5.74

### Placement (x,y rotation side)
C1  72.95,31.24 315 top
C2  59.56,18.16 135 top
C3  85.22,35.43 0 top
C4  85.98,37.59 0 top
C5  80.39,35.43 180 top
C6  79.63,37.59 180 top
C7  73.03,10.79 90 top
C8  60.45,19.05 135 top
C9  73.88,32.09 315 top
C10  70.78,33.44 135 top
C11  73.28,20.95 45 top
C12  69.98,17.78 45 top
C13  57.4,20.32 315 top
C14  58.17,30.99 225 top
C15  61.56,34.33 45 top
C18  92.46,3.3 0 top
C21  33.66,26.67 90 bottom
C22  36.83,43.18 270 bottom
C23  36.2,27.3 270 bottom
C24  34.92,43.18 270 bottom
C25  64.14,41.91 90 top
C26  53.68,35.95 45 top
C27  56,38.26 225 top
D1  71.12,10.79 90 top
E1  1.27,16.51 90 top
IC1  46.23,42.42 0 top
J1  26.67,9.53 0 top
J2  54.61,9.53 0 top
J3  97.79,27.3 180 top
J4  95.25,53.98 180 top
J4A  92.71,29.84 90 top
J4B  95.25,47.62 270 top
J5  24.13,9.53 90 top
J7  81.28,32.38 270 top
J8  27.94,33.66 270 top
J9  43.18,26.04 90 top
J10  83.82,32.38 270 top
J11  86.36,32.38 270 top
J12  62.23,12.06 180 top
J14  64.77,50.16 0 top
JP2  92.71,50.16 0 top
LED1  24.77,49.53 90 top
LED2  24.77,47.62 90 top
LED3  24.77,45.72 90 top
POWER_LED  77.09,44.83 180 top
Q1  57.35,34.86 225 top
R1  76.83,10.79 90 top
R2  74.93,10.79 270 top
R3  14.86,46.74 0 bottom
R4  20.95,49.53 0 top
R5  20.95,47.62 0 top
R6  20.95,45.72 0 top
R7  64.14,38.61 270 top
R8  77.09,41.27 90 top
R9  54.99,24.77 270 top
R10  53.59,24.77 270 top
R11  32.26,15.62 0 top
R12  32.26,14.22 0 top
R13  32.26,18.41 0 top
R14  32.26,12.83 0 top
R15  32.26,17.02 0 top
R16  8.26,12.06 180 bottom
R17  8.26,10.54 180 bottom
S1  66.93,40.26 90 top
SG1  11.43,47.62 270 top
T1  14.73,49.53 0 bottom
U1  81.79,43.56 0 top
U2  94.48,9.39 270 top
U3  39.37,26.04 0 top
U$1  [PIF_SSTOP_5MM]  106.17,21.46 90 top
U$2  3.81,1.91 0 top
U$3  66.17,25.91 135 top
U$4  [PIF_LOGO_5X5MM]  8.51,20.19 270 bottom

### Tracks (layer width: path | path; a pad name or v marks a point on that pad's centre or on a via)
1A
  Top 0.203: U3.2 33.02,40.01 39.85,40.01 41.91,37.94 45.4,37.94 46.2,38.73 46.2,39.21 IC1.4
2A  (via drill 0.35)
  Top 0.203: v48.74,37.62 48.74,39.21 IC1.6
  Bottom 0.203: v48.74,37.62 48.74,29.21 43.5,23.97 32.07,23.97 30.48,25.56 30.48,27.3 U3.7
3A  (via drill 0.35)
  Top 0.203: v46.35,43.81 47.47,44.93 47.47,45.4 IC1.10 | v38.58,37.47 38.58,37.15 38.1,36.67 38.1,29.84 U3.10
  Bottom 0.203: v46.35,43.81 40.01,37.47 v38.58,37.47
4A  (via drill 0.35)
  Top 0.203: v44.93,47.15 44.93,45.56 IC1.12
  Bottom 0.203: v44.93,47.15 44.93,46.83 U3.15
+3.3V_BB
  Bottom 0.406: U$2.P9.4 U$2.P9.3
+3.3V_INPUT  (via drill 0.35)
  Top 0.203: U$3.37 62.2,32.35 | 62.2,32.35 60.96,33.6 C15.1 60.96,33.81 60.96,34.92 63.66,37.62 64.14,37.62 R7.2 | U$3.42 60.42,30.58 | 60.42,30.58 59.41,31.59 C14.1 58.74,31.59 57.63,31.59 56.04,30 56.04,28.57 58.58,26.04 61.12,26.04 62.18,24.97 62.18,24.01 62.39,23.8 | C11.1 72.68,20.41 72.26,20.83 72.26,21.57 U$3.11 70.96,22.86 70.33,23.5 70.17,23.5 | C13.1 59.42,20.92 U$3.54 62.3,23.8 62.39,23.8 | v62.39,32.54 62.23,32.38 62.2,32.35 | 60.42,30.58 v60.17,30.32 | 60.48,30.64 60.42,30.58 | 66.99,20.48 63.98,23.5 62.69,23.5 62.39,23.8 | 66.99,20.48 67.79,19.68 U$3.2 68.96,18.52 68.96,17.65 69.38,17.24 C12.1 69.53,17.14 69.53,16.19 70.17,15.56 70.17,10.95 69.69,10.48 68.26,10.48 67.94,10.79 66.04,10.79 J2.5 64.14,9.53 62.87,8.26 57.78,8.26 | 70.17,23.5 67.15,20.48 66.99,20.48 | 70.17,23.5 68.9,24.77 68.9,29.69 69.69,30.48 U$3.26 71.38,32.2 C10.1 71.44,32.86 v72.87,34.29 | 57.78,8.26 58.42,7.62 58.42,3.81 60.01,2.22 92.23,2.22 93.19,3.17 C18.2 | 57.78,8.26 55.88,8.26 J2.1 | v18.57,17.46 17.78,16.67 17.78,9.05 E1.12 | v24.77,43.5 28.57,43.5 36.51,51.44 57.78,51.44 58.42,52.07 58.42,53.34 59.05,53.98 62.87,53.98 63.5,53.34 63.5,52.07 64.14,51.44 66.04,51.44 J14.2 68.1,49.37 68.1,43.66 73.5,38.26 | v75.25,36.04 75.25,36.51 73.5,38.26 | 73.5,38.26 v72.87,37.62
  Top 0.305: U2.18 92.98,3.63 C18.2
  Top 0.406: J7.1 J10.2
  Top 0.61: POWER_LED.A 81.01,45.88 U1.4 U1.2 81.79,37.77 C6.1 81.24,37.22 C5.1 81.24,32.42 J7.1
  Bottom 0.203: v60.17,30.32 v62.39,32.54 | J7.1 77.79,32.38 75.25,34.92 v75.25,36.04 | v72.87,37.62 v72.87,34.29
  Bottom 0.305: v18.57,17.46 18.59,17.46 23.36,22.23 24.77,22.23 25.65,23.11 25.65,42.61 v24.77,43.5
+5V_INPUT
  Top 0.406: U3.16 41.05,45.49 IC1.14
  Top 0.61: U1.3 84.1,37.69 C4.1 84.37,37.22 C3.1 84.37,32.93 J10.1 J11.1
  Bottom 0.406: 26.49,44.38 30.06,44.38 30.74,45.06 32.76,45.06 33.79,44.03 C24.1 C22.1 39.16,44.03 U3.16 | 26.49,44.38 SG1.+ | 93.78,25.84 J3.2 | 93.78,25.84 87.71,19.76 87.71,19.13 81.36,12.78 81.36,3.89 80.57,3.1 31.19,3.1 29.85,4.45 U$2.P9.5 | J11.1 91.36,27.38 91.36,26.75 92.27,25.84 93.78,25.84 | J4.5 92.71,54.61 91.36,53.26 91.36,52.15 92.71,50.8 JP2.1 83.82,41.27 J10.1 | J1.1 26.49,9.71 26.49,19.36 26.41,19.42 26.16,19.71 25.98,20.04 25.85,20.39 25.78,20.77 25.78,21.14 25.85,21.52 25.98,21.87 26.16,22.2 26.41,22.49 26.49,22.55 26.49,44.38
  Bottom 0.61: U$2.P9.5 U$2.P9.6 J1.1 J5.1
+12V_INPUT
  Bottom 0.406: C23.A 36.11,25.82 C21.1 33.44,26.04 U3.8
  Bottom 0.61: J4.3 94.76,55.24 93.31,56.69 92.11,56.69 90.65,55.23 90.65,49.25 87.5,46.1 75.44,46.1 72.82,48.72 56.2,48.72 41.73,34.26 41.73,26.49 39.93,24.69 38.81,24.69 37.6,25.91 C23.A
BUZZER
  Bottom 0.203: U$2.P8.32 60.96,53.98 60.96,52.07 60.33,51.44 48.1,51.44 42.55,45.88 14.92,45.88 14.13,46.67 R3.2
CC1101_SPI_CSN  (via drill 0.35)
  Top 0.203: v89.06,22.23 89.06,19.68 88.74,19.37 88.74,13.45 87.49,12.2 87.49,11.3 88.9,9.89 U2.12 90.33,10 | v87.31,20.95 85.72,20.95 85.09,20.32 85.09,19.05 84.45,18.41 81.6,18.41 v80.17,19.84 | U$3.9 71.28,21.16 v71.28,20.8
  Bottom 0.203: v89.06,22.23 88.58,22.23 v87.31,20.95 | v80.17,19.84 72.23,19.84 v71.28,20.8
CC1101_SPI_GDO0  (via drill 0.35)
  Top 0.203: v68.42,34.45 69.53,35.56 73.18,35.56 76.04,32.7 76.04,21.27 74.77,20 74.77,16.99 75.88,15.88 75.88,11.11 76.2,10.79 77.47,10.79 77.79,11.11 80.49,11.11 81.92,12.54 85.6,12.54 89.25,8.89 90.33,8.89 U2.13 | v66.04,26.51 60.96,26.51 59.85,27.62 U$3.47
  Bottom 0.203: v68.42,34.45 68.42,29.69 68.58,29.53 68.58,29.05 v66.04,26.51
CC1101_SPI_GDO2  (via drill 0.35)
  Top 0.203: v62.87,14.76 62.87,15.56 v61.59,16.83 | v63.34,22.7 62.39,21.75 U$3.57 | 90.33,7.78 U2.14 90.36,7.87 89.28,7.87 86.36,4.95 84.33,4.95 83.03,6.25 81.81,6.25 81.36,6.7 81.36,7.65 80.44,8.57 v79.57,8.57
  Bottom 0.203: v79.57,8.57 73.34,8.57 71.44,10.48 68.26,10.48 66.52,12.22 65.41,12.22 v62.87,14.76 | v61.59,16.83 61.59,20.95 v63.34,22.7
CC1101_SPI_MISO  (via drill 0.35)
  Top 0.203: v88.58,11.75 90.49,11.75 U2.10 | v83.19,5.08 82.55,5.71 79.38,5.71 78.74,6.35 78.74,8.73 v78.11,9.37 | v69.37,11.27 69.37,15.72 68.26,16.83 68.26,18.5 U$3.1
  Bottom 0.203: v78.11,9.37 73.82,9.37 71.91,11.27 v69.37,11.27 | v88.58,11.75 88.58,8.57 85.09,5.08 v83.19,5.08
CC1101_SPI_MOSI  (via drill 0.35)
  Top 0.203: v89.85,24.61 89.85,19.84 89.22,19.21 89.22,13.35 87.9,12.03 87.9,11.46 88.47,10.89 U2.11 90.33,10.95 | v70.33,19.84 70.01,19.84 69.7,19.54 69.34,19.54 U$3.4
  Bottom 0.203: v89.85,24.61 89.85,25.72 87,28.57 74.77,28.57 71.28,25.08 67.94,25.08 67.47,24.61 67.47,22.7 v70.33,19.84
CC1101_SPI_SCLK  (via drill 0.35)
  Top 0.203: v90.33,13.81 90.33,13.02 U2.9 | v82.23,11.75 81.76,11.75 80.64,10.64 78.9,10.64 v78.58,10.32 | v68.58,12.06 61.75,18.89 61.75,20.42 U$3.58
  Bottom 0.203: v90.33,13.81 84.3,13.81 v82.23,11.75 | v78.58,10.32 73.5,10.32 71.75,12.06 v68.58,12.06
CC1101_UART_RX
  Top 0.203: R14.1 31.43,12.86 31.43,14.13 R12.1 31.27,14.29 24.45,14.29 J5.3
CC1101_UART_SET
  Top 0.203: R13.1 25.4,18.41 J5.5
CC1101_UART_TX
  Top 0.203: R11.1 31.43,15.72 31.43,16.99 R15.1 31.27,17.14 J5.4
DEBUG_TCK  (via drill 0.35)
  Top 0.203: U$3.52 59.41,22.35 v59.37,22.35
  Bottom 0.203: v59.37,22.35 59.37,14.92 J12.1
DEBUG_TDI  (via drill 0.35)
  Top 0.203: v57.47,15.08 57.47,12.38 J12.3 | U$3.50 60.8,25.14 v60.8,25.24
  Bottom 0.203: v60.8,25.24 57.47,21.91 v57.47,15.08
DEBUG_TDO  (via drill 0.35)
  Top 0.203: v52.86,16.83 52.86,18.26 56.67,22.07 56.99,22.07 59.37,24.45 U$3.49
  Bottom 0.203: v52.86,16.83 52.86,13.34 54.13,12.06 J12.4
DEBUG_TMS  (via drill 0.35)
  Top 0.203: U$3.51 59.41,23.04 59.09,23.04 58.42,22.36 v58.42,21.75
  Bottom 0.203: v58.42,21.75 58.42,18.89 58.9,18.41 58.9,12.86 J12.2
GND  (via drill 0.35, 3)
  Top 0.203: C27.2 54.3,36.57 C26.2 | U$3.12 72.58,21.97 73.34,21.97 | 73.34,21.97 73.41,21.97 73.82,21.56 C11.2 | U$3.3 69.4,18.8 70.1,18.8 70.52,18.38 C12.2 | C13.2 C2.2 C8.2 59.85,20.67 U$3.55 | U$3.39 62.65,30.5 63.64,29.5 | 63.64,29.5 v64.03,29.11 | C15.2 62.16,34.51 U$3.34 64.45,32.23 64.14,31.91 | U$3.27 67.81,29.31 v67.77,29.31 | C9.2 73.63,30.64 C1.2 73.5,30.64 v72.71,29.84 | IC1.7 v50.04,37.34 50.16,37.31 50.16,36.2 50.32,36.04 50.32,35.4 47.31,32.38 40.64,32.38 U3.12 U3.13 | J4.2 97.63,52.55 97.63,47.78 J4B.2 | v71.14,12.88 71.12,13.02 71.12,17.62 v71.27,17.68 71.28,17.78 74.45,20.95 v74.57,20.83 | J2.6 69.37,9.53 71.75,11.91 71.75,11.95 | J10.3 83.82,27.46 86.2,29.84 J11.2 87.63,31.11 87.63,33.5 86.2,34.92 86.2,35.24 C3.2 | v91.28,24.92 91.92,24.29 91.92,15.4 v91.97,15.39 | C5.2 79.69,35.24 79.69,31.59 81.28,30 J7.2 | 73.34,21.97 73.34,23.18 75.25,25.08 75.25,30.64 v75.26,30.68 | J1.10 50.32,9.53 51.28,10.48 51.28,12.06 53.66,14.45 55.09,14.45 | 55.88,14.45 55.09,14.45 | 55.09,14.45 58.1,17.46 58.1,17.94 v58.17,18.06 | J14.1 64.77,43.5 64.78,43.41 | 63.64,29.5 64.77,30.64 | 69.37,30.83 U$3.27 | S1.2 66.99,43.34 66.99,39.53 68.1,38.42 68.1,35.24 67.63,34.77 67.63,32.7 U$3.32 68.98,34.04 C10.2 70.17,33.97 70.17,31.67 U$3.27 | U$2.P9.2 21.27,9.84 21.14,9.89 | 22.23,10.64 22.7,10.64 J5.2 26.04,12.06 28.57,9.53 J1.2 | 22.23,10.64 21.27,10.64 E1.14 | 22.23,10.64 22.23,20 21.27,20.95 E1.21 | 20.11,48.58 12.7,48.58 v12.65,48.44 | 24.13,53.5 20.16,49.53 R4.1 | U3.4 31.75,34.13 | 26.67,39.21 31.75,34.13 | 26.67,39.21 26.67,41.91 26.04,42.55 20.95,42.55 20.16,43.34 20.16,45.72 R6.1 | 31.75,34.13 U3.5
  Top 0.203: 21.14,21.48 21.27,21.43 23.38,21.43 24.31,22.36 24.9,22.36 26.67,24.13 26.67,39.21
  Top 0.254: J2.2 57.15,10.27 55.88,11.54 55.88,14.45 v55.88,14.48
  Top 0.305: v91.97,15.39 U2.8 U2.17 91.98,3.67 C18.1 v90.27,3.3 | v71.14,12.88 71.12,12.85 D1.A 71.75,11.95 72.72,11.95 C7.2 R2.1 | E1.22 20.11,22.51 v20.22,22.4 21.14,21.48 E1.21 | E1.13 19.3,9.04 v20.3,9.04 21.14,9.89 E1.14 | v19.07,49.55 19.1,49.53 R4.1 20.11,48.58 R5.1 R6.1 | v63.09,42.77 63.11,42.76 C25.2 64.78,43.41 S1.2 | v62.92,35.76 62.92,35.69 C15.2 | v56.79,29.64 56.82,29.64 C14.2 | v53.59,37.29 v53.59,37.28 54.3,36.57 | C9.2 74.48,31.47 v75.26,30.68 | C10.2 70.17,34.13 v70.84,34.8 | R8.1 76.06,40.42 v76,40.49 | 87.96,38.91 C4.2 | 87.96,38.91 v88.42,39.37 | v87.45,39.37 87.5,39.37 87.96,38.91 | U$2.P8.2 24.13,53.5 U$2.P8.1 | C2.2 58.87,18.76 v58.17,18.06 | C12.2 v71.27,17.68 | C11.2 73.88,21.52 v74.57,20.83
  Top 0.406: J10.3 J7.2
  Top 0.61: J4B.2 J4B.4 J4B.6 J4B.8 J4B.10 J4B.12 J4B.14 J4B.16 J3.1 | J4.6 J4.4 J4.2 | U1.1 77.13,40.46 R8.1 77.09,38.15 C6.2 79.54,35.7 C5.2 | C4.2 87.96,37.33 C3.2
  Bottom 0.203: C22.2 C24.2 | J7.2 80.49,30.64 75.41,30.64 v75.26,30.68 | J11.2 v91.28,24.92 | J4B.12 97.16,34.92 95.89,36.2 91.6,36.2 v88.42,39.37 | v50.04,37.34 50.16,37.31 53.5,37.31 v53.59,37.29 53.66,37.15 56.83,33.97 56.83,30.32 | 56.83,30.32 56.83,29.69 v56.79,29.64 56.83,29.53 63.66,29.53 63.98,29.21 v64.03,29.11 64.14,29.21 67.63,29.21 v67.77,29.31 | 56.83,30.32 54.45,27.94 54.45,16.03 55.88,14.61 v55.88,14.48 | v36.2,30 36.2,30.48 U3.12 | v34.95,41.22 34.92,41.12 34.92,39.37 U3.4 U3.13 | v72.71,29.84 72.71,33.02 70.96,34.77 v70.84,34.8
  Bottom 0.305: C24.2 34.92,41.25 v34.95,41.22 | C23.C v36.2,30 | T1.E v12.66,48.43 v12.65,48.44
  Bottom 0.406: U$2.P9.2 U$2.P9.1 | C21.2 34.84,28.7 C23.C
  other vias: 58.42,43.18 59.69,43.18 53.34,41.27 51.94,38.23 46.48,31.88 46.48,33.66 50.55,27.43 51.82,27.43 36.2,22.1 37.47,22.1 42.42,19.18 35.94,37.47 34.67,37.47 34.8,29.97 87.12,15.62 80.26,15.11 79.76,22.35 87.38,42.04 85.6,44.58 71.5,44.07 21.84,56.77 87,13.08 90.3,32.26 90.72,36.83 90.72,41.4 18.41,53.98 84.45,50.8 84.45,8.89 18.41,5.71 38.1,49.53 43.18,49.53 48.26,49.53 52.07,49.53
  pour Top (isolate 0.305): 9.53,59.05 106.68,59.05 106.68,0.64 0.64,0.64 0.64,22.86 24.77,22.86 24.77,41.91 9.53,41.91
  pour Bottom (isolate 0.254): 9.53,59.05 9.53,41.91 24.77,41.91 24.77,22.86 0.64,22.86 0.64,0.64 106.68,0.64 106.68,59.05
HM10_RX  (via drill 0.35)
  Top 0.203: 2.7,9.05 E1.2 2.77,10.01 3.24,10.48 v4.13,10.48
  Bottom 0.203: v4.13,10.48 7.3,10.48 R17.1
HM10_TX  (via drill 0.35)
  Top 0.203: 1.27,9.05 E1.1 1.27,10.16 3.17,12.06 v4.29,12.06
  Bottom 0.203: v4.29,12.06 R16.1
I2C1_SCL  (via drill 0.35)
  Top 0.203: v39.85,11.91 v42.7,11.91 | v66.36,53.98 67.94,53.98 68.58,53.34 68.58,43.81 79.22,33.18 79.22,29.37 J7.3
  Bottom 0.203: U$2.P9.17 44.45,5.08 43.18,6.35 43.18,11.43 v42.7,11.91 | v39.85,11.91 39.85,15.56 30,25.4 30,33.66 31.27,34.92 40.01,34.92 56.04,50.96 62.39,50.96 63.5,52.07 63.5,53.34 64.14,53.98 v66.36,53.98
I2C1_SDA  (via drill 0.35)
  Top 0.203: U$2.P9.18 44.45,7.62 45.72,8.89 45.72,10.16 v47.47,11.91 | v47.47,17.3 47.47,18.73 46.2,20 v46.2,23.65 | v51.59,34.29 51.59,36.35 v54.77,39.53 | v69.06,39.53 69.85,39.53 77.63,31.75 77.63,28.42 J7.4
  Bottom 0.203: v47.47,17.3 v47.47,11.91 | v46.2,23.65 46.2,26.04 51.59,31.43 v51.59,34.29 | v69.06,39.53 v54.77,39.53
I2C2_SCL  (via drill 0.35)
  Top 0.203: U$2.P9.19 46.99,5.08 48.26,6.35 48.26,7.62 48.9,8.26 50.16,8.26 51.75,9.84 51.75,11.91 53.5,13.65 v55.09,13.65 | v56.67,13.65 56.67,15.4 57.15,15.88 57.78,15.88 58.42,15.24 58.42,14.29 | 58.42,14.29 58.42,10.79 J2.3 | 58.42,14.29 v60.17,16.03
  Bottom 0.203: v56.67,13.65 v55.09,13.65 | J10.6 82.55,19.68 80.96,18.1 74.45,18.1 72.39,16.03 v60.17,16.03
I2C2_SDA  (via drill 0.35)
  Top 0.203: U$2.P9.20 46.35,6.99 45.09,5.71 43.81,5.71 43.18,6.35 43.18,10.16 49.05,16.03 v55.56,16.03 | J2.4 v65.72,13.02
  Bottom 0.203: v55.56,16.03 56.67,14.92 56.67,14.76 58.42,13.02 58.42,11.43 59.05,10.79 60.96,10.79 J2.4 | J10.7 79.38,17.14 75.72,13.49 71.6,13.49 71.44,13.65 66.36,13.65 v65.72,13.02
LED_1
  Top 0.203: LED1.A 28.57,49.53 U$2.P8.7
LED_2
  Top 0.203: LED2.A 29.21,47.62 U$2.P8.9
LED_3
  Top 0.203: LED3.A 29.84,45.72 U$2.P8.11
LIDAR_PWM1  (via drill 0.35)
  Top 0.203: v68.58,14.61 67.79,15.4 67.79,17.94 64.77,20.95 64.41,20.95 U$3.61 | v78.42,17.3 78.42,19.21 80.17,20.95 85.09,20.95 J11.5
  Bottom 0.203: v68.58,14.61 71.28,14.61 71.91,13.97 75.09,13.97 v78.42,17.3
LIDAR_PWM2  (via drill 0.35)
  Top 0.203: v63.34,18.41 63.34,19.21 63.98,19.84 U$3.62
  Bottom 0.203: v63.34,18.41 67.15,18.41 67.31,18.57 80.8,18.57 83.19,20.95 85.09,20.95 J11.6
MCU_I2C1_SCL  (via drill 0.35)
  Top 0.203: v63.98,45.24 63.98,47.31 64.14,47.47 64.14,48.42 v62.55,50.01 | U$3.23 69.75,28.42 v69.69,28.42
  Bottom 0.203: v69.69,28.42 69.69,32.54 70.01,32.86 70.01,39.69 64.45,45.24 v63.98,45.24 | v62.55,50.01 63.5,50.96 63.5,51.28 63.66,51.44 71.12,51.44 J14.4
MCU_I2C1_SDA  (via drill 0.35)
  Top 0.203: v74.77,42.7 74.77,45.24 J14.3 | U$3.24 71.1,30.48 v71.91,30.48
  Bottom 0.203: v71.91,30.48 71.91,29.53 73.03,28.42 73.98,28.42 74.45,28.89 74.45,42.39 v74.77,42.7
MCU_I2C2_SCL  (via drill 0.35)
  Top 0.203: v62.55,19.21 62.23,19.53 62.23,20.21 U$3.59
  Bottom 0.203: v62.55,19.21 69.85,19.21 70.01,19.05 80.49,19.05 82.55,21.11 82.55,22.86 83.19,23.5 87,23.5 87.63,24.13 87.63,26.04 J11.3
MCU_I2C2_SDA  (via drill 0.35)
  Top 0.203: v69.06,23.5 v67.31,21.75 | U$3.60 64.49,21.75 v64.58,21.75
  Bottom 0.203: v67.31,21.75 v64.58,21.75 | v69.06,23.5 78.11,23.5 80.64,26.04 85.09,26.04 J11.4
MCU_RESET
  Top 0.203: C25.1 R7.1 64.14,39.37 | 64.14,39.37 64.61,39.37 66.83,37.15 S1.1 | 64.14,39.37 59.85,35.08 59.85,33.5 60.8,32.54 61.28,32.54 62.87,30.96 U$3.38
MCU_UART0_RX  (via drill 0.35)
  Top 0.203: v30.32,13.34 v23.18,13.34 22.86,13.65 22.86,20.33 24.48,21.96 25.16,21.96 26.7,23.5 30.96,23.5 33.02,25.56 33.02,36.67 32.23,37.47 31.27,37.47 30.48,38.26 30.48,44.77 33.66,47.94 49.37,47.94 51.28,46.04 v54.77,46.04 | v34.29,15.24 33.5,15.24 33.18,15.56 R11.2 | v73.66,29.21 73.66,28.1 73.03,27.46 U$3.17
  Bottom 0.203: R16.2 21.91,12.06 v23.18,13.34 | v30.32,13.34 32.38,13.34 v34.29,15.24 | v73.66,29.21 73.66,37.94 65.56,46.04 v54.77,46.04
MCU_UART0_TX  (via drill 0.35)
  Top 0.203: v24.77,21.27 25.24,21.27 26.99,23.02 30,23.02 35.08,17.94 35.08,14.92 | 35.08,14.92 34.45,14.29 33.18,14.29 R12.2 | U$3.18 70.77,25.91 v70.77,25.88 | 35.08,14.92 44.93,24.77 v57.94,24.77
  Bottom 0.203: v24.77,21.27 23.81,21.27 19.21,16.67 12.22,16.67 8.26,12.7 8.26,11.43 9.05,10.64 R17.2 | v70.77,25.88 66.52,25.88 66.36,25.72 62.07,25.72 61.28,26.51 59.69,26.51 v57.94,24.77
MCU_UART1_RX  (via drill 0.35)
  Top 0.203: v55.24,27.62 53.66,26.04 53.66,25.72 R10.1 | v57.94,28.73 58.42,28.73 58.9,29.21 59.67,29.21 U$3.45
  Bottom 0.203: v55.24,27.62 56.83,27.62 v57.94,28.73
MCU_UART1_TX  (via drill 0.35)
  Top 0.203: v56.2,25.72 55.09,25.72 R9.1 | v58.1,27.62 58.1,27.78 59.05,28.73 59.46,28.73 U$3.46
  Bottom 0.203: v58.1,27.62 v56.2,25.72
MPU9250_INT  (via drill 0.35)
  Top 0.203: U$2.P9.25 54.61,5.08 55.88,6.35 55.88,7.62 55.24,8.26 53.5,8.26 52.55,9.21 v52.55,11.59 | v48.9,11.59 47.78,12.7 47.15,12.7 44.45,10 J1.8
  Bottom 0.203: v48.9,11.59 v52.55,11.59
N$1
  Bottom 0.254: 101.35,58.55 105.41,58.55 arc-90 106.05,57.91 106.05,27.43 arc-90 105.41,26.8 101.35,26.8 arc-90 100.71,27.43 100.71,57.91 arc-90 101.35,58.55
N$3
  Top 0.61: JP2.2 J4B.1 J4B.3 J4B.5 J4B.7 J4B.9 J4B.11 J4B.13 J4B.15
N$8
  Bottom 0.203: T1.C 14.61,50.64 11.59,50.64 11.43,50.8 SG1.-
N$9
  Bottom 0.203: R3.1 15.72,46.83 15.72,48.42 T1.B
N$13
  Top 0.203: LED1.C R4.2
N$14
  Top 0.203: LED2.C R5.2
N$15
  Top 0.203: LED3.C R6.2
N$18
  Bottom 0.203: U3.3 27.94,34.92 J8.1
N$19
  Top 0.203: U3.6 31.75,30.32 27.94,26.51 J8.4
N$20
  Top 0.203: IC1.2 43.81,39.37 44.93,39.37 IC1.3
N$23
  Top 0.203: IC1.11 46.35,45.56 46.35,46.2 46.99,46.83 49.21,46.83 50.01,46.04 50.01,45.56 IC1.8
N$26
  Top 0.203: U3.11 39.37,30.32 43.18,26.51 J9.1
N$27
  Top 0.203: U3.14 39.37,37.94 43.18,34.13 J9.4
N$28
  Top 0.203: U$3.41 58.66,33.06 Q1.2 55.37,33.06 C26.1
N$29
  Top 0.203: U$3.40 59.14,33.29 Q1.1 56.93,38.86 C27.1
N$30
  Top 0.61: POWER_LED.C R8.2
N$34  (via drill 0.35)
  Top 0.203: v29.53,19.21 29.69,19.37 32.07,19.37 33.02,18.41 R13.2 | v30.48,6.03 30.16,6.03 29.84,5.71 28.57,5.71 27.94,5.08 27.94,3.81 29.53,2.22 54.29,2.22 55.88,3.81 55.88,5.71 U$2.P9.28
  Bottom 0.203: v29.53,19.21 29.53,11.11 30.48,10.16 v30.48,6.03
RC_IN  (via drill 0.35)
  Top 0.203: U$2.P8.15 41.91,53.34 43.18,54.61 43.18,55.88 44.77,57.47 97.95,57.47 v99.54,55.88
  Bottom 0.203: v99.54,55.88 99.54,29.69 98.42,28.57 93.98,28.57 J3.3
RC_OUT1  (via drill 0.35)
  Top 0.203: J4A.1 93.98,31.11 93.98,45.72 93.34,46.35 91.92,46.35 91.03,47.24 91.03,50.54 v87.6,53.98
  Bottom 0.203: U$2.P8.28 57.78,55.24 59.05,53.98 60.33,53.98 60.96,54.61 60.96,55.88 61.59,56.52 85.06,56.52 v87.6,53.98
RC_OUT2  (via drill 0.35)
  Top 0.203: J4A.2 92.71,33.02 89.69,36.04 89.69,43.34 v85.88,47.15 | v77.31,47.15 73.03,51.44 71.75,51.44 71.12,52.07 71.12,53.34 70.48,53.98 69.22,53.98 68.58,54.61 68.58,55.88 67.94,56.52 59.05,56.52 58.42,55.88 58.42,53.98 U$2.P8.27
  Bottom 0.203: v77.31,47.15 v85.88,47.15
RC_OUT3
  Bottom 0.203: U$2.P8.30 61.75,57.31 95.09,57.31 96.52,55.88 96.52,50.8 99.06,48.26 99.06,34.29 98.42,33.66 93.98,33.66 J4A.3
RC_OUT4  (via drill 0.35)
  Top 0.203: U$2.P8.29 59.69,51.28 v63.34,47.62
  Bottom 0.203: v63.34,47.62 70.96,47.62 82.55,36.04 82.55,31.75 83.19,31.11 84.45,31.11 85.09,31.75 85.09,38.1 87.15,40.16 90.01,40.16 J4A.4
RC_OUT5  (via drill 0.35)
  Top 0.203: v93.98,51.12 93.66,51.12 93.34,51.44 92.08,51.44 86.52,56.99 74.14,56.99 U$2.P8.40
  Bottom 0.203: J4A.5 92.71,40.64 93.98,41.91 v93.98,51.12
RC_OUT6  (via drill 0.35)
  Top 0.203: v87.38,47.91 87.38,47.88 J4A.6
  Bottom 0.203: U$2.P8.39 73.03,52.7 77.82,47.91 v87.38,47.91
RC_OUT7
  Top 0.203: U$2.P8.42 76.2,53.98 86.36,53.98 90.63,49.71 90.63,47.07 91.75,45.95 91.85,45.95 J4A.7
RC_OUT8
  Top 0.203: U$2.P8.41 74.93,53.34 73.66,54.61 73.66,55.88 74.3,56.52 86.36,56.52 91.44,51.44 91.44,48.9 J4A.8
SPI1_CS1  (via drill 0.35)
  Top 0.203: v50.48,10.79 48.26,10.79 J1.9
  Bottom 0.203: U$2.P9.42 74.3,6.99 73.03,8.26 59.05,8.26 58.42,8.89 58.42,10.16 57.78,10.79 v50.48,10.79
SPI1_MISO  (via drill 0.35)
  Top 0.203: v57.47,23.65 v52.07,18.26 | v68.26,24.29 v62.87,24.29 | v77.63,12.86 v77.63,24.29 | v82.23,4.6 82.87,3.97 82.87,3.17 82.39,2.7 61.44,2.7 U$2.P9.29 | v80.49,9.84 80.49,9.22 82.17,7.54 v82.17,6.99
  Bottom 0.203: J1.7 41.91,13.65 46.51,18.26 v52.07,18.26 | v57.47,23.65 58.1,23.65 60.48,26.04 61.12,26.04 v62.87,24.29 | v77.63,24.29 v68.26,24.29 | v77.63,12.86 80.49,10 v80.49,9.84 | v82.23,4.6 82.23,6.92 v82.17,6.99
SPI1_MOSI  (via drill 0.35)
  Top 0.203: U$2.P9.30 60.33,6.99 61.59,5.71 70.48,5.71 71.12,5.08 71.12,3.81 71.75,3.17 81.76,3.17 v82.07,3.49 | v30.16,3.02 32.23,3.02 33.02,3.81 v33.02,6.03
  Bottom 0.203: v82.07,3.49 81.76,3.49 80.8,2.54 30.64,2.54 v30.16,3.02 | v33.02,6.03 33.02,8.26 J1.4
SPI1_SCLK  (via drill 0.35)
  Top 0.203: J1.3 32.38,9.53 35.24,12.38 39.21,12.38 39.53,12.7 43.5,12.7 v43.81,13.02
  Bottom 0.203: v43.81,13.02 45.24,13.02 47.47,10.79 47.62,10.79 48.26,10.16 48.26,8.89 48.9,8.26 57.78,8.26 58.42,7.62 58.42,6.35 59.05,5.71 60.96,5.71 U$2.P9.31
UART1_RX
  Top 0.203: U$2.P9.26 53.34,5.71 53.34,3.81 52.23,2.7 36.67,2.7 35.56,3.81 35.56,7.62 34.92,8.26 31.11,8.26 30.48,8.89 30.48,10.16 32.23,11.91 32.23,16.35 32.38,16.51 32.54,16.51 33.02,16.99 R15.2
UART1_TX  (via drill 0.35)
  Top 0.203: v42.86,13.49 42.39,13.97 40.01,13.97 38.89,12.86 33.18,12.86 R14.2
  Bottom 0.203: v42.86,13.49 42.86,12.86 44.93,10.79 45.09,10.79 45.72,10.16 45.72,6.35 46.35,5.71 50.8,5.71 U$2.P9.24
UART4_RX
  Top 0.203: U$2.P9.11 38.1,5.71 38.1,10.16 38.73,10.79 42.7,10.79 54.93,23.02 54.93,23.81 R9.2
UART4_TX  (via drill 0.35)
  Top 0.203: v41.75,14.76 46.04,14.76 53.5,22.23 53.5,23.81 R10.2
  Bottom 0.203: v41.75,14.76 41.75,14.29 40.64,13.18 40.64,5.71 U$2.P9.13
UART5_RX
  Top 0.203: U$2.P8.38 70.48,55.24 71.75,53.98 73.03,53.98 73.66,53.34 73.66,52.07 77.63,48.1 83.82,48.1 89.22,42.7 89.22,28.26 87,26.04 85.72,26.04 85.09,25.4 85.09,23.5 J10.5
UART5_TX  (via drill 0.35)
  Top 0.203: U$2.P8.37 69.85,52.07 71.12,50.8 71.12,49.53 75.88,44.77 v75.88,41.59 | v78.11,33.18 78.11,28.57 80.64,26.04 82.55,26.04 J10.4
  Bottom 0.203: v75.88,41.59 78.11,39.37 v78.11,33.18
US_EN1  (via drill 0.35)
  Top 0.203: v49.69,40.96 48.42,40.96 46.83,42.55 33.02,42.55 U3.1 | U$3.29 67.38,30.32 v67.47,30.32
  Bottom 0.203: v67.47,30.32 65.72,30.32 61.91,34.13 57.78,34.13 50.96,40.96 v49.69,40.96
US_EN2  (via drill 0.35)
  Top 0.203: v63.98,35.72 63.98,34.45 66.83,31.59 67.25,31.59 U$3.31 | v60.96,38.73 57.94,38.73 v51.44,45.24
  Bottom 0.203: v60.96,38.73 v63.98,35.72 | v51.44,45.24 51.44,44.93 40.64,34.13 40.64,27.3 U3.9
US_PWM1  (via drill 0.35)
  Top 0.203: v69.22,33.18 69.69,32.7 69.69,31.91 69.06,31.27 U$3.28 | v54.61,34.92 v58.1,34.92 | v49.53,35.72 47.62,37.62 47.62,39.21 IC1.5 47.47,39.37 47.47,40.01 46.67,40.8 43.34,40.8 42.55,40.01 42.55,39.37 IC1.1
  Bottom 0.203: v69.22,33.18 69.22,34.77 68.74,35.24 64.61,35.24 64.29,34.92 v58.1,34.92 | v54.61,34.92 52.07,34.92 51.28,35.72 v49.53,35.72
US_PWM2  (via drill 0.35)
  Top 0.203: v63.34,27.3 67.15,31.11 67.5,31.11 U$3.30 | v57.63,25.88 57.63,26.35 50.8,33.18 50.8,42.86 50.64,43.02 | 50.64,43.02 48.9,44.77 48.9,45.4 IC1.9 | 50.64,43.02 45.56,43.02 43.81,44.77 43.81,45.4 IC1.13
  Bottom 0.203: v63.34,27.3 59.05,27.3 v57.63,25.88
VBAT
  Top 0.406: J4.1 99.14,53.9 99.14,26.75 98.17,25.78 89.79,25.78 88.27,24.26 88.27,19.69 80.22,11.64 R1.2
VBAT_SENSE
  Top 0.203: 74.93,10 73.03,10 C7.1 73.03,9.84 72.87,9.68 71.12,9.68 D1.C 71.12,5.71 U$2.P9.39 | 74.93,10 76.83,10 R1.1 | 74.93,10 R2.2
VDDC  (via drill 0.35)
  Top 0.203: U$3.25 71.74,31.84 C1.1 73.2,32.7 C9.1 73.34,32.54 74.61,32.54 74.77,32.38 v75.25,32.38 | U$3.56 61.05,21.15 C8.1 | C2.1 60.17,17.62 60.96,18.41 C8.1 | v62.71,16.83 61.12,18.41 C8.1 | v72.23,16.99 73.66,16.99 v74.3,16.35 | v75.56,17.3 75.56,20.16 76.83,21.43 v76.83,31.43
  Bottom 0.203: v62.71,16.83 72.07,16.83 v72.23,16.99 | v74.3,16.35 74.61,16.35 v75.56,17.3 | v76.83,31.43 76.2,31.43 v75.25,32.38

### Text on the board
Bottom: SNSH_PilotCape v1.0 | Designed by NghiaJenius
tNames: + | 5V / 12V / VBAT | - | 5V / ESC | 8 | LSM9DS1 | 7 | 6 | 5 | 4 | US1 | US2 | 3 | 2 | 1 | SNSH_PilotCape v1.0 | Designed by NghiaJenius | MPU-9250 | PPM | 5V | GND | RF CC110L | BMP280 | OLED / GPS / LIDAR | BLE HM-10